# EAGLE design res_v2 (EAGLE 6.5.0)
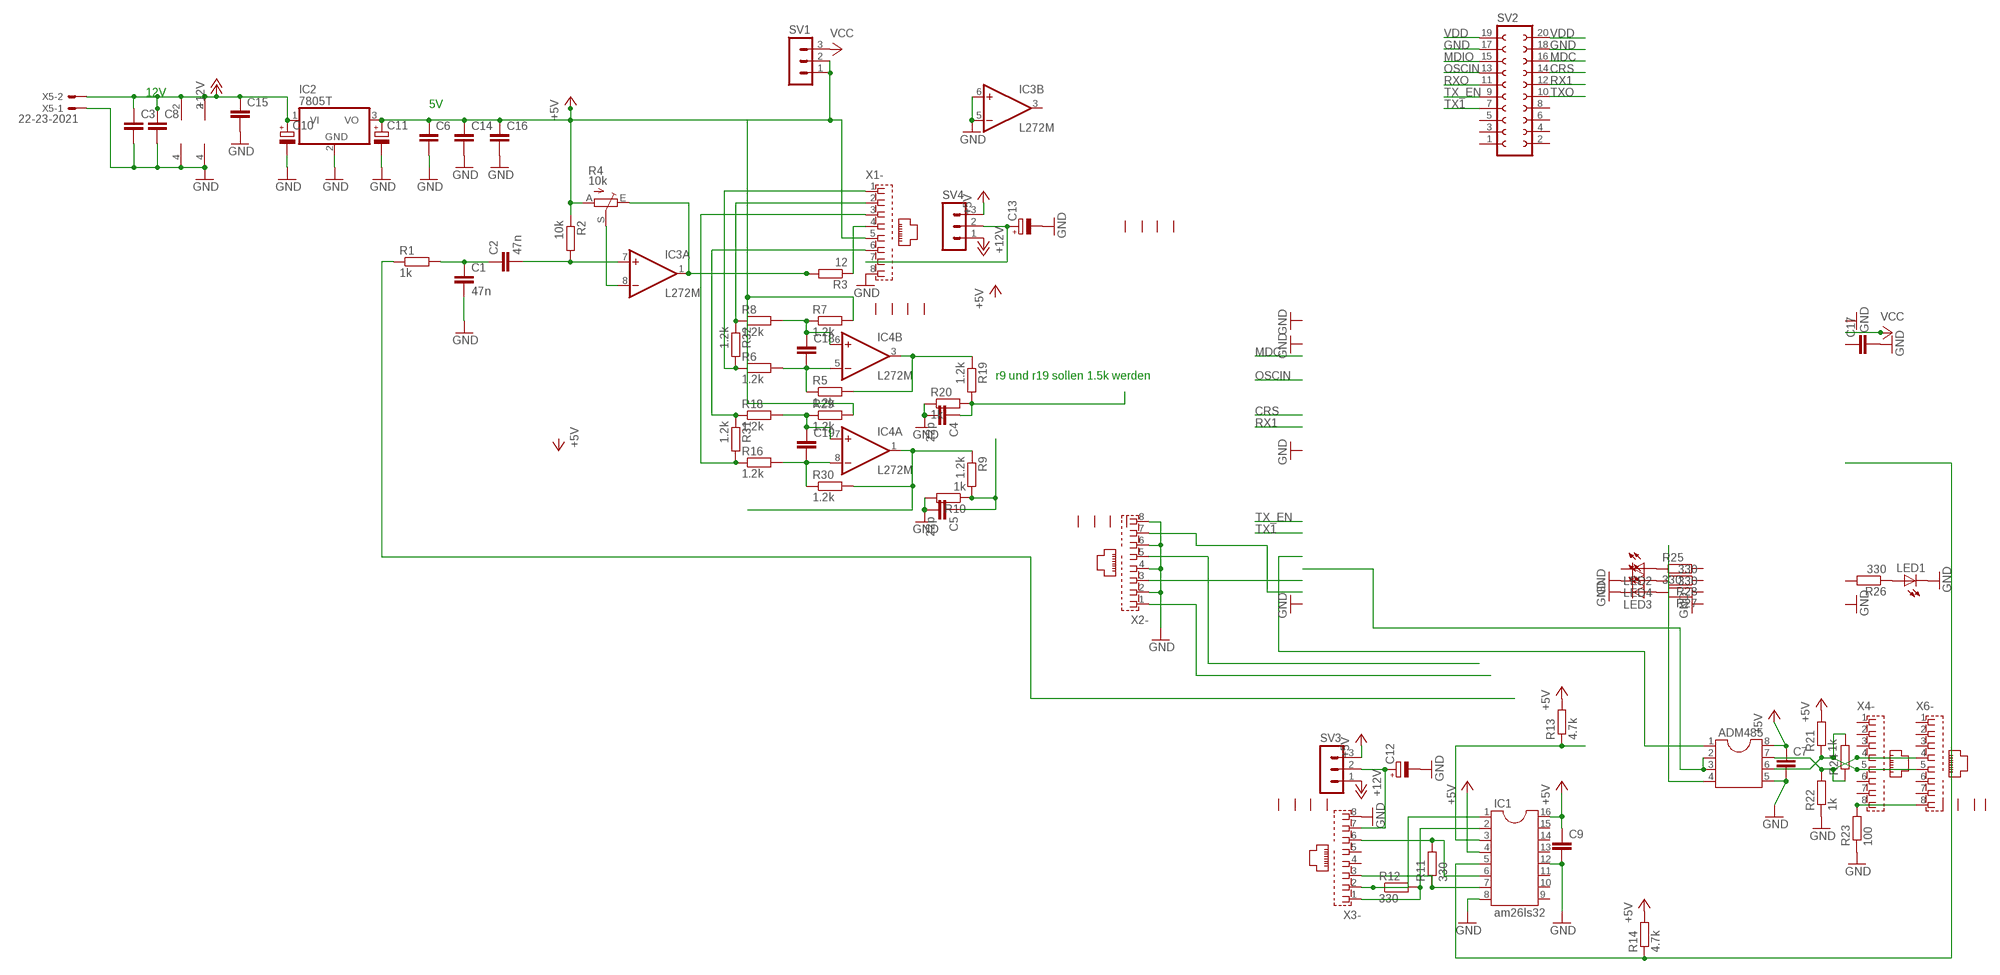
[diagram p0: schematic, sheet 1]

## Parts
ADM485  DIL8  [DIL08]
C1  47n  C-EU050-025X075  [C050-025X075]
C2  47n  C-EU050-025X075  [C050-025X075]
C3  C-EU050-025X075  [C050-025X075]
C4  22p  C-EU050-025X075  [C050-025X075]
C5  22p  C-EU050-025X075  [C050-025X075]
C6  C-EU050-025X075  [C050-025X075]
C7  C-EU050-025X075  [C050-025X075]
C8  C-EU050-025X075  [C050-025X075]
C9  C-EU050-025X075  [C050-025X075]
C10  CPOL-EUE2.5-5  [E2,5-5]
C11  CPOL-EUE2.5-5  [E2,5-5]
C12  CPOL-EUE2.5-5  [E2,5-5]
C13  CPOL-EUE2.5-5  [E2,5-5]
C14  C-EU050-025X075  [C050-025X075]
C15  C-EU050-025X075  [C050-025X075]
C16  C-EU050-025X075  [C050-025X075]
C17  C-EU050-025X075  [C050-025X075]
C18  C-EU050-025X075  [C050-025X075]
C19  C-EU050-025X075  [C050-025X075]
IC1  am26ls32  DIL16  [DIL16]
IC2  7805T  [TO220H]
IC3  L272M  [DIL08]
IC4  L272M  [DIL08]
LED1  LED3MM  [LED3MM]
LED2  LED3MM  [LED3MM]
LED3  LED3MM  [LED3MM]
LED4  LED3MM  [LED3MM]
R1  1k  R-EU_0204/7  [0204/7]
R2  10k  R-EU_0204/7  [0204/7]
R3  12  R-EU_0204/7  [0204/7]
R4  10k  TRIM_EU-CA6V  [CA6V]
R5  1.2k  R-EU_0204/7  [0204/7]
R6  1.2k  R-EU_0204/7  [0204/7]
R7  1.2k  R-EU_0204/7  [0204/7]
R8  1.2k  R-EU_0204/7  [0204/7]
R9  1.2k  R-EU_0204/7  [0204/7]
R10  1k  R-EU_0204/7  [0204/7]
R11  330  R-EU_0204/7  [0204/7]
R12  330  R-EU_0204/7  [0204/7]
R13  4.7k  R-EU_0204/7  [0204/7]
R14  4.7k  R-EU_0204/7  [0204/7]
R16  1.2k  R-EU_0204/7  [0204/7]
R18  1.2k  R-EU_0204/7  [0204/7]
R19  1.2k  R-EU_0204/7  [0204/7]
R20  1k  R-EU_0204/7  [0204/7]
R21  1k  R-EU_0204/7  [0204/7]
R22  1k  R-EU_0204/7  [0204/7]
R23  100  R-EU_0204/7  [0204/7]
R24  R-EU_0204/7  [0204/7]
R25  330  R-EU_0204/7  [0204/7]
R26  330  R-EU_0204/7  [0204/7]
R27  330  R-EU_0204/7  [0204/7]
R28  330  R-EU_0204/7  [0204/7]
R29  1.2k  R-EU_0204/7  [0204/7]
R30  1.2k  R-EU_0204/7  [0204/7]
R31  1.2k  R-EU_0204/7  [0204/7]
R32  1.2k  R-EU_0204/7  [0204/7]
SV1  MA03-1  [MA03-1]
SV2  FE10-2W  [FE10-2W]
SV3  MA03-1  [MA03-1]
SV4  MA03-1  [MA03-1]
X1  RJ45  [RJ45]
X2  RJ45  [RJ45]
X3  RJ45  [RJ45]
X4  RJ45  [RJ45]
X5  22-23-2021  [22-23-2021]
X6  RJ45  [RJ45]

## Nets
+5V: ADM485.8 C6.1 C7.1 C9.1 C11.+ C14.1 C16.1 IC1.4 IC1.16 IC2.3(VO) R2.1 R4.A R7.2 R13.2 R14.2 R21.2 R29.2 SV3.3 SV4.3
+12V: C3.1 C8.1 C10.+ C15.1 IC2.1(VI) IC3.2(P:V+) IC4.2(P:V+) SV3.1 SV4.1 X5.2
CRS: SV2.14
GND: ADM485.5 C1.2 C3.2 C4.2 C5.2 C6.2 C7.2 C8.2 C9.2 C10.- C11.- C12.- C13.- C14.2 C15.2 C16.2 C17.2 IC1.8 IC1.12 IC2.2(GND) IC3.4(P:GND) IC3.5(B:-IN) IC3.6(B:+IN) IC4.4(P:GND) LED1.K(C) LED3.K(C) LED4.K(C) R10.2 R20.1 R22.1 R23.1 SV2.17 SV2.18 X1.8 X2.2 X2.4 X2.6 X2.8 X3.8 X5.1
MDC: SV2.16
MDIO: SV2.15
N$1: IC3.8(A:-IN) R4.S
N$2: IC3.1(A:OUT) R3.2 R4.E
N$3: C2.2 IC3.7(A:+IN) R2.2
N$4: R1.1
N$5: C1.1 C2.1 R1.2
N$6: R3.1 X1.4
N$8: R8.1 R32.1 X1.2
N$9: R6.1 R32.2 X1.1
N$10: C18.2 IC4.5(B:-IN) R5.1 R6.2
N$11: C18.1 IC4.6(B:+IN) R7.1 R8.2
N$12: IC4.3(B:OUT) R5.2 R19.1
N$13: IC4.1(A:OUT) R9.1 R30.2
N$14: X2.7
N$15: C12.+ SV3.2 X3.7
N$16: X2.1
N$17: IC1.6 R11.2 X3.6
N$18: X2.5
N$19: X2.3
N$20: C4.1 R19.2 R20.2
N$21: R16.1 R31.2 X1.3
N$22: IC1.3 R13.1
N$23: IC1.5 R14.1
N$24: IC1.2 R12.2 X3.1
N$25: IC1.1 R12.1 X3.2
N$26: IC1.7 R11.1 X3.3
N$27: C13.+ SV4.2 X1.7
N$28: C19.1 IC4.7(A:+IN) R18.2 R29.1
N$29: SV1.1 SV1.2 X1.5
N$30: R18.1 R31.1 X1.6
N$31: C19.2 IC4.8(A:-IN) R16.2 R30.1
N$37: ADM485.4
N$40: C5.1 R9.2 R10.1
N$41: ADM485.1
N$42: ADM485.2 ADM485.3
N$43: ADM485.6 R21.1 R24.2 X4.5 X6.5
N$44: ADM485.7 R22.2 R24.1 X4.4 X6.4
N$45: R23.2 X4.8 X6.8
N$46: LED2.A R25.1
N$50: LED1.A R26.1
N$52: LED3.A R27.2
N$53: LED4.A R28.2
OSCIN: SV2.13
RX1: SV2.12
RXO: SV2.11
TX1: SV2.7
TX_EN: SV2.9
TXO: SV2.10
VCC: SV1.3
VDD: SV2.19 SV2.20
Unconnected: C17.1 IC1.9 IC1.10 IC1.11 IC1.13 IC1.14 IC1.15 IC3.3(B:OUT) LED2.K(C) R25.2 R26.2 R27.1 R28.1 SV2.1 SV2.2 SV2.3 SV2.4 SV2.5 SV2.6 SV2.8 X1.G1 X1.G2 X1.G3 X1.G4 X2.G1 X2.G2 X2.G3 X2.G4 X3.4 X3.5 X3.G1 X3.G2 X3.G3 X3.G4 X4.1 X4.2 X4.3 X4.6 X4.7 X4.G1 X4.G2 X4.G3 X4.G4 X6.1 X6.2 X6.3 X6.6 X6.7 X6.G1 X6.G2 X6.G3 X6.G4

## Notes on the sheet
- 12V
- 5V
- r9 und r19 sollen 1.5k werden

## Library data of the parts
ADM485 = ic-package:DIL8: Dual In Line / Socket
C1-C9 C14-C19 = rcl:C-EU: CAPACITOR, European symbol
C10-C13 = rcl:CPOL-EU: POLARIZED CAPACITOR, European symbol
IC1 = ic-package:DIL16: Dual In Line / Socket
IC2 = linear:78*: Positive VOLTAGE REGULATOR Source: http://cache.national.com/ds/LM/LM78L05.pdf http://www.fairchildsemi.com/ds/LM/LM7805.pdf
IC3 IC4 = linear:L272: OP AMP
LED1-LED4 = led:LED: LED OSRAM: - CHIPLED LG R971, LG N971, LY N971, LG Q971, LY Q971, LO R971, LY R971 LH N974, LH R974 LS Q976, LO Q976, LY Q976 LO Q996 - Hyper CHIPLED LW Q18S LB Q993, LB Q99A, LB R99A - SideLED LS A670, LO A670, LY A670, LG A670, LP A670 LB A673, LV A673, LT A673, LW A673 LH A674 LY A675 LS A676, LA A676, LO A676, LY A676, LW A676 LS A679, LY A679, LG A679 - Hyper Micro SIDELED® LS Y876, LA Y876, LO Y876, LY Y876 LT Y87S - SmartLED LW L88C, LW L88S LB L89C, LB L89S, LG L890 LS L89K, LO L89K, LY L89K LS L896, LA L896, LO L896, LY L896 - TOPLED LS T670, LO T670, LY T670, LG T670, LP T670 LSG T670, LSP T670, LSY T670, LOP T670, LYG T670 LG T671, LOG T671, LSG T671 LB T673, LV T673, LT T673, LW T673 LH T674 LS T676, LA T676, LO T676, LY T676, LB T676, LH T676, LSB T676, LW T676 LB T67C, LV T67C, LT T67C, LS T67K, LO T67K, LY T67K, LW E67C LS E67B, LA E67B, LO E67B, LY E67B, LB E67C, LV E67C, LT E67C LW T67C LS T679, LY T679, LG T679 LS T770, LO T770, LY T770, LG T770, LP T770 LB T773, LV T773, LT T773, LW T773 LH T774 LS E675, LA E675, LY E675, LS T675 LS T776, LA T776, LO T776, LY T776, LB T776 LHGB T686 LT T68C, LB T68C - Hyper Mini TOPLED® LB M676 - Mini TOPLED Santana® LG M470 LS M47K, LO M47K, LY M47K Source: http://www.osram.convergy.de LUXEON: - LUMILED® LXK2-PW12-R00, LXK2-PW12-S00, LXK2-PW14-U00, LXK2-PW14-V00 LXK2-PM12-R00, LXK2-PM12-S00, LXK2-PM14-U00 LXK2-PE12-Q00, LXK2-PE12-R00, LXK2-PE12-S00, LXK2-PE14-T00, LXK2-PE14-U00 LXK2-PB12-K00, LXK2-PB12-L00, LXK2-PB12-M00, LXK2-PB14-N00, LXK2-PB14-P00, LXK2-PB14-Q00 LXK2-PR12-L00, LXK2-PR12-M00, LXK2-PR14-Q00, LXK2-PR14-R00 LXK2-PD12-Q00, LXK2-PD12-R00, LXK2-PD12-S00 LXK2-PH12-R00, LXK2-PH12-S00 LXK2-PL12-P00, LXK2-PL12-Q00, LXK2-PL12-R00 Source: www.luxeon.com KINGBRIGHT: KA-3528ASYC Source: www.kingbright.com
R1-R3 R5-R14 R16 R18-R32 = resistor:R-EU_: RESISTOR, European symbol
R4 = pot:TRIM_EU-: POTENTIOMETER
SV1 SV3 SV4 = con-lstb:MA03-1: PIN HEADER; OC_FARNELL: unknown; OC_NEWARK: unknown
SV2 = con-lsta:FE10-2W: FEMALE HEADER; OC_FARNELL: unknown; OC_NEWARK: unknown
X1-X4 X6 = con-appsys:RJ45: AMP connector
X5 = con-molex:22-23-2021: .100" (2.54mm) Center Header - 2 Pin; MF: MOLEX; MPN: 22-23-2021; OC_FARNELL: 1462926; OC_NEWARK: 25C3832

## Net classes
0 default: clearance 0.205 mm

## Board
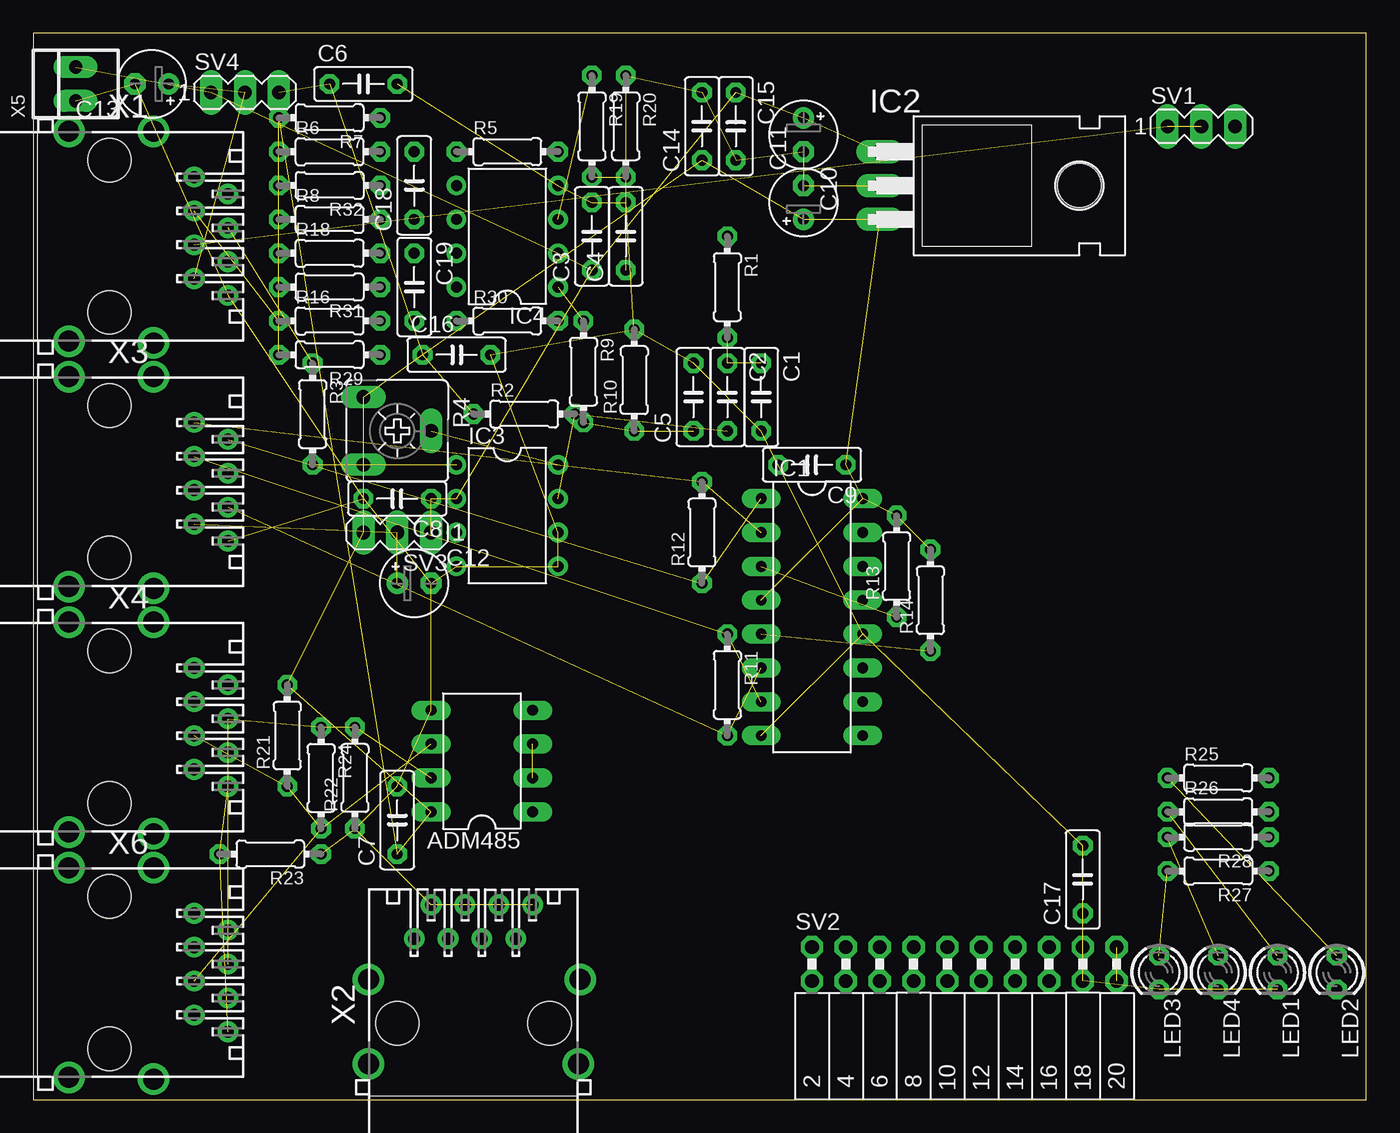
[diagram p1: board, top side]
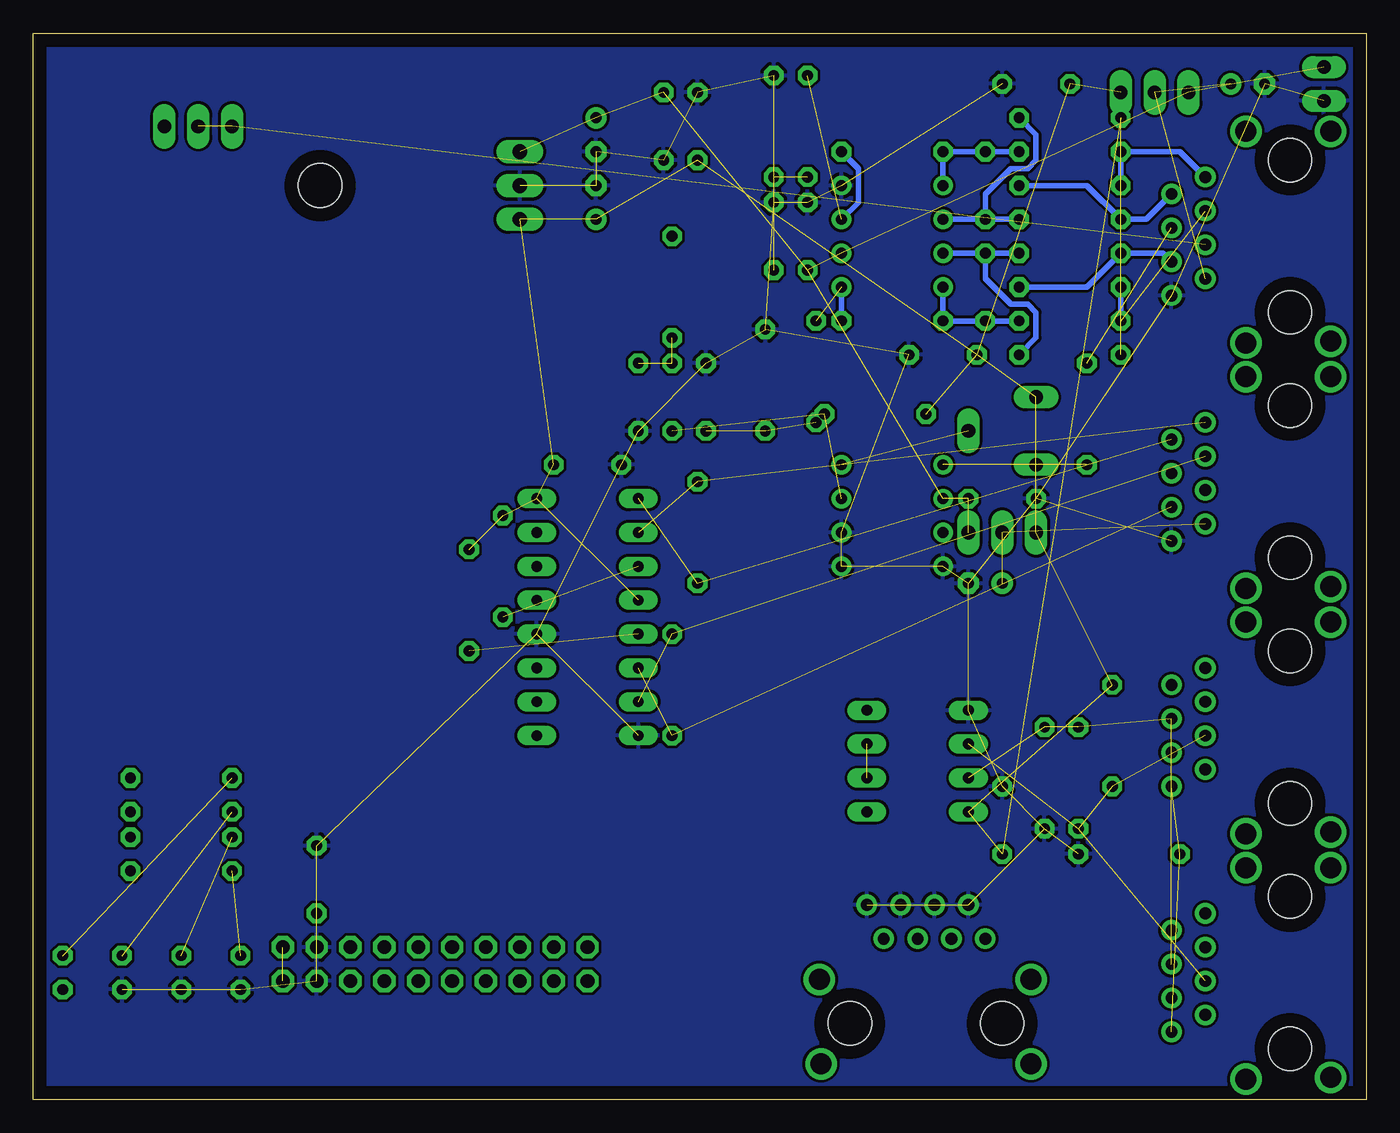
[diagram p2: board, bottom side, seen from below]

Size 100 x 80 mm. Coordinates in mm from the lower left corner, seen from the top.
Outline: 0,0 100,0 100,80 0,80 0,0
Copper layers (1*16): Top 0.035mm / dielectric 1.5mm / Bottom 0.035mm
Design rules "default *": minimum track width 10mil, minimum drill 31mil, track to track 8mil, track to pad 8mil, pad to pad 8mil, via to via 8mil, smd to smd 8mil, copper to edge 40mil, drill to drill 8mil, minimum pad ring 13mil, minimum via ring 8mil, stop-mask expansion 4mil, vias tented up to drill 0mil, thermal gap 10mil

### Footprints (pad centres in the part's own frame; a part is rotated, then mirrored left to right if it is on the bottom)
DIL08 = drill 0.813 long: 1 -3.81,-3.81; 2 -1.27,-3.81; 3 1.27,-3.81; 4 3.81,-3.81; 5 3.81,3.81; 6 1.27,3.81; 7 -1.27,3.81; 8 -3.81,3.81
C050-025X075 = drill 0.813 octagon: 1 -2.54,0; 2 2.54,0
E2,5-5 = drill 0.813 pad 1.6: + -1.27,0 | drill 0.813 pad 1.6 octagon: - 1.27,0
DIL16 = drill 0.813 long: 1 -8.89,-3.81; 2 -6.35,-3.81; 3 -3.81,-3.81; 4 -1.27,-3.81; 5 1.27,-3.81; 6 3.81,-3.81; 7 6.35,-3.81; 8 8.89,-3.81; 9 8.89,3.81; 10 6.35,3.81; 11 3.81,3.81; 12 1.27,3.81; 13 -1.27,3.81; 14 -3.81,3.81; 15 -6.35,3.81; 16 -8.89,3.81
TO220H = drill 1.118 long: 1 -2.54,-10.16; 2 0,-10.16; 3 2.54,-10.16 | hole 3.302: 0,4.826
DIL08' = drill 0.813 pad 1.27: 1 -3.81,-3.81; 2 -1.27,-3.81; 3 1.27,-3.81; 4 3.81,-3.81; 5 3.81,3.81; 6 1.27,3.81; 7 -1.27,3.81; 8 -3.81,3.81
LED3MM = drill 0.813 octagon: A -1.27,0; K 1.27,0
0204/7 = drill 0.813 octagon: 1 -3.81,0; 2 3.81,0
CA6V = drill 1.016 long: A -2.54,-2.54; E 2.54,-2.54; S 0,2.54
MA03-1 = drill 1.016 long: 1 -2.54,0; 2 0,0; 3 2.54,0
FE10-2W = drill 1.016 octagon: 1 -11.43,1.27; 2 -11.43,-1.27; 3 -8.89,1.27; 4 -8.89,-1.27; 5 -6.35,1.27; 6 -6.35,-1.27; 7 -3.81,1.27; 8 -3.81,-1.27; 9 -1.27,1.27; 10 -1.27,-1.27; 11 1.27,1.27; 12 1.27,-1.27; 13 3.81,1.27; 14 3.81,-1.27; 15 6.35,1.27; 16 6.35,-1.27; 17 8.89,1.27; 18 8.89,-1.27; 19 11.43,1.27; 20 11.43,-1.27
RJ45 = drill 0.889: 1 -4.445,6.35; 2 -3.175,8.89; 3 -1.905,6.35; 4 -0.635,8.89; 5 0.635,6.35; 6 1.905,8.89; 7 3.175,6.35; 8 4.445,8.89 | drill 1.575 pad 2.184: G1 -7.874,-3.048; G2 7.874,-3.048; G3 -7.874,3.302; G4 8.001,3.302 | hole 3.251: -5.715,0; 5.715,0
22-23-2021 = drill 1 long: 1 -1.27,0; 2 1.27,0

### Placement (x,y rotation side)
ADM485  33.66,25.4 90 top
C1  54.61,52.7 270 top
C2  52.07,52.7 270 top
C3  41.91,64.77 90 top
C4  44.45,64.77 90 top
C5  49.53,52.7 90 top
C6  24.77,76.2 0 top
C7  27.3,20.96 90 top
C8  27.3,45.08 180 top
C9  58.42,47.62 180 top
C10  57.78,72.39 270 top
C11  57.78,67.31 90 top
C12  28.57,38.73 0 top
C13  8.89,76.2 180 top
C14  50.16,73.03 90 top
C15  52.7,73.03 270 top
C16  31.75,55.88 0 top
C17  78.74,16.51 90 top
C18  28.57,68.58 90 top
C19  28.57,60.96 270 top
IC1  58.42,36.2 270 top
IC2  73.66,68.58 270 top
IC3  L272M  [DIL08']  35.56,43.81 270 top
IC4  L272M  [DIL08']  35.56,64.77 90 top
LED1  93.34,9.53 270 top
LED2  97.79,9.53 270 top
LED3  84.45,9.53 270 top
LED4  88.9,9.53 270 top
R1  52.07,60.96 270 top
R2  36.83,51.43 0 top
R3  20.95,51.43 270 top
R4  27.3,50.16 270 top
R5  35.56,71.12 0 top
R6  22.23,71.12 0 top
R7  22.23,73.66 180 top
R8  22.23,66.04 0 top
R9  41.27,54.61 270 top
R10  45.09,53.97 90 top
R11  52.07,31.11 270 top
R12  50.16,42.54 90 top
R13  64.77,40 90 top
R14  67.31,37.46 90 top
R16  22.23,58.42 0 top
R18  22.23,63.5 0 top
R19  41.91,73.03 270 top
R20  44.45,73.03 270 top
R21  19.05,27.3 90 top
R22  24.13,24.13 90 top
R23  17.78,18.41 180 top
R24  21.59,24.13 270 top
R25  88.9,24.13 0 top
R26  88.9,21.59 0 top
R27  88.9,17.14 180 top
R28  88.9,19.68 180 top
R29  22.23,55.88 180 top
R30  35.56,58.42 0 top
R31  22.23,60.96 180 top
R32  22.23,68.58 180 top
SV1  87.63,73.03 0 top
SV2  69.85,10.16 0 top
SV3  27.3,42.54 180 top
SV4  15.88,75.56 0 top
X1  5.71,64.77 270 top
X2  33.02,5.71 0 top
X3  5.71,46.35 270 top
X4  5.71,27.94 270 top
X5  3.17,76.2 90 top
X6  5.71,9.53 270 top

### Tracks (layer width: path | path; a pad name or v marks a point on that pad's centre or on a via)
+5V  (18 unrouted)
+12V  (9 unrouted)
GND  (39 unrouted)
  pour Bottom: 0,80.65 101.6,80.65 100.97,-0.64 -0.64,-0.64
N$1  (1 unrouted)
N$2  (2 unrouted)
N$3  (2 unrouted)
N$5  (2 unrouted)
N$6  (1 unrouted)
N$8
  Bottom 0.406: X1.2 16.51,66.04 R8.1 20.95,68.58 R32.1
N$9
  Bottom 0.406: X1.1 13.97,71.12 R6.1 R32.2
N$10
  Bottom 0.406: IC4.5 R5.1 C18.2 R6.2
N$11
  Bottom 0.406: IC4.6 C18.1 | C18.1 R8.2 | R7.1 24.77,72.39 24.77,70.48 25.4,69.85 26.67,69.85 28.57,67.95 C18.1
N$12  (1 unrouted)
  Bottom 0.406: R5.2 38.1,69.85 38.1,67.31 IC4.3
N$13  (1 unrouted)
  Bottom 0.406: R30.2 IC4.1
N$15  (2 unrouted)
N$17  (2 unrouted)
N$20  (2 unrouted)
N$21  (1 unrouted)
  Bottom 0.406: R31.2 R16.1
N$22  (1 unrouted)
N$23  (1 unrouted)
N$24  (2 unrouted)
N$25  (2 unrouted)
N$26  (2 unrouted)
N$27  (2 unrouted)
N$28
  Bottom 0.406: C19.1 IC4.7 | C19.1 R18.2 | R29.1 24.77,57.15 24.77,59.05 25.4,59.69 26.67,59.69 28.57,61.59 C19.1
N$29  (2 unrouted)
N$30
  Bottom 0.406: X1.6 15.24,63.5 R18.1 20.95,60.96 R31.1
N$31
  Bottom 0.406: R16.2 C19.2 R30.1 IC4.8
N$40  (2 unrouted)
N$42  (1 unrouted)
N$43  (4 unrouted)
N$44  (4 unrouted)
N$45  (2 unrouted)
N$46  (1 unrouted)
N$50  (1 unrouted)
N$52  (1 unrouted)
N$53  (1 unrouted)
VDD  (1 unrouted)